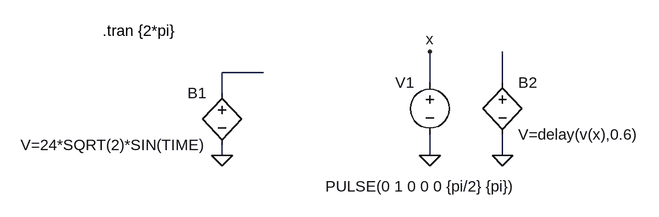
[diagram p0: schematic Delay.asc]
Delay.asc, the LTspice schematic file:
Version 4
SHEET 1 880 680
WIRE 208 128 144 128
WIRE 464 144 464 96
WIRE 576 144 576 96
WIRE 144 160 144 128
WIRE 144 256 144 240
WIRE 464 256 464 224
WIRE 576 256 576 224
FLAG 144 256 0
FLAG 576 256 0
FLAG 464 96 x
FLAG 464 256 0
SYMBOL bv 144 144 M0
SYMATTR InstName B1
SYMATTR Value V=24*SQRT(2)*SIN(TIME)
SYMBOL bv 576 128 R0
SYMATTR InstName B2
SYMATTR Value V=delay(v(x),0.6)
SYMBOL voltage 464 128 M0
WINDOW 3 -133 176 Left 2
WINDOW 123 0 0 Left 2
WINDOW 39 0 0 Left 2
SYMATTR InstName V1
SYMATTR Value PULSE(0 1 0 0 0 {pi/2} {pi})
TEXT -40 64 Left 2 !.tran {2*pi}

The netlist it stands for:
* Delay.asc
B1 N001 0 V=24*SQRT(2)*SIN(TIME)
B2 N002 0 V=delay(v(x),0.6)
V1 x 0 PULSE(0 1 0 0 0 {pi/2} {pi})
.tran {2*pi}
.backanno
.end